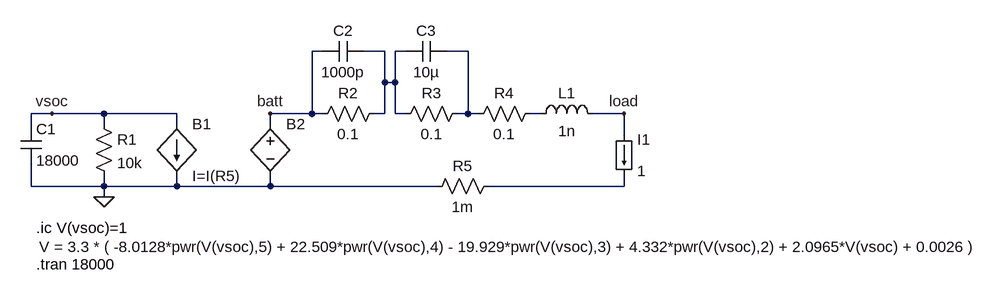
[diagram p0: schematic battery.asc]
battery.asc, the LTspice schematic file:
Version 4
SHEET 1 2072 680
WIRE 624 160 608 160
WIRE 720 160 688 160
WIRE 752 160 736 160
WIRE 848 160 816 160
WIRE 720 208 720 160
WIRE 736 208 736 160
WIRE 736 208 720 208
WIRE 208 256 176 256
WIRE 288 256 208 256
WIRE 400 256 288 256
WIRE 608 256 608 160
WIRE 608 256 544 256
WIRE 624 256 608 256
WIRE 720 256 720 208
WIRE 720 256 704 256
WIRE 736 256 736 208
WIRE 752 256 736 256
WIRE 848 256 848 160
WIRE 848 256 832 256
WIRE 864 256 848 256
WIRE 960 256 944 256
WIRE 1088 256 1040 256
WIRE 176 272 176 256
WIRE 288 272 288 256
WIRE 400 272 400 256
WIRE 544 272 544 256
WIRE 1088 288 1088 256
WIRE 176 368 176 336
WIRE 288 368 288 352
WIRE 288 368 176 368
WIRE 400 368 400 352
WIRE 400 368 288 368
WIRE 544 368 544 352
WIRE 544 368 400 368
WIRE 800 368 544 368
WIRE 1088 368 1088 352
WIRE 1088 368 880 368
WIRE 288 384 288 368
FLAG 288 384 0
FLAG 208 256 vsoc
FLAG 544 256 batt
FLAG 1088 256 load
SYMBOL res 272 256 R0
SYMATTR InstName R1
SYMATTR Value 10k
SYMBOL Cap 160 272 R0
SYMATTR InstName C1
SYMATTR Value 18000
SYMBOL bi 400 272 R0
SYMATTR InstName B1
SYMATTR Value I=I(R5)
SYMBOL bv 544 256 R0
WINDOW 3 -356 205 Left 2
SYMATTR Value V = 3.3 * ( -8.0128*pwr(V(vsoc),5) + 22.509*pwr(V(vsoc),4) - 19.929*pwr(V(vsoc),3) + 4.332*pwr(V(vsoc),2) + 2.0965*V(vsoc) + 0.0026 )
SYMATTR InstName B2
SYMBOL res 720 240 R90
WINDOW 0 0 56 VBottom 2
WINDOW 3 32 56 VTop 2
SYMATTR InstName R2
SYMATTR Value 0.1
SYMBOL res 848 240 R90
WINDOW 0 0 56 VBottom 2
WINDOW 3 32 56 VTop 2
SYMATTR InstName R3
SYMATTR Value 0.1
SYMBOL res 960 240 R90
WINDOW 0 0 56 VBottom 2
WINDOW 3 32 56 VTop 2
SYMATTR InstName R4
SYMATTR Value 0.1
SYMBOL cap 688 144 R90
WINDOW 0 0 32 VBottom 2
WINDOW 3 32 32 VTop 2
SYMATTR InstName C2
SYMATTR Value 1000p
SYMBOL cap 816 144 R90
WINDOW 0 0 32 VBottom 2
WINDOW 3 32 32 VTop 2
SYMATTR InstName C3
SYMATTR Value 10µ
SYMBOL Ind 944 272 R270
WINDOW 0 32 56 VTop 2
WINDOW 3 5 56 VBottom 2
SYMATTR InstName L1
SYMATTR Value 1n
SYMBOL Res 896 352 R90
WINDOW 0 0 56 VBottom 2
WINDOW 3 32 56 VTop 2
SYMATTR InstName R5
SYMATTR Value 1m
SYMBOL load 1072 288 R0
SYMATTR InstName I1
SYMATTR Value 1
TEXT 184 432 Left 2 !.ic V(vsoc)=1
TEXT 184 488 Left 2 !.tran 18000

The netlist it stands for:
* battery.asc
R1 vsoc 0 10k
C1 vsoc 0 18000
B1 vsoc 0 I=I(R5)
B2 batt 0 V = 3.3 * ( -8.0128*pwr(V(vsoc),5) + 22.509*pwr(V(vsoc),4) - 19.929*pwr(V(vsoc),3) + 4.332*pwr(V(vsoc),2) + 2.0965*V(vsoc) + 0.0026 )
R2 N001 batt 0.1
R3 N002 N001 0.1
R4 N003 N002 0.1
C2 N001 batt 1000p
C3 N002 N001 10µ
L1 N003 load 1n
R5 N004 0 1m
I1 load N004 1
.ic V(vsoc)=1
.tran 18000
.backanno
.end